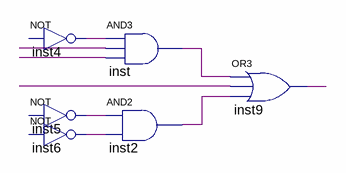
[diagram p0: schematic sheet]
// Quartus schematic pjc.bdf as structural Verilog: 6 symbols, 0 pins
module pjc (
);

  wire inst2_out, inst4_out, inst5_out, inst6_out, inst9_out, inst_out, undriven, undriven_2, undriven_3;

  // NOT inst4 has open pins: IN=open, OUT=inst4_out
  // NOT inst5 has open pins: IN=open, OUT=inst5_out
  // NOT inst6 has open pins: IN=open, OUT=inst6_out
  and inst (inst_out, inst4_out, undriven, undriven_2);
  and inst2 (inst2_out, inst5_out, inst6_out);
  or inst9 (inst9_out, inst_out, undriven_3, inst2_out);
endmodule
